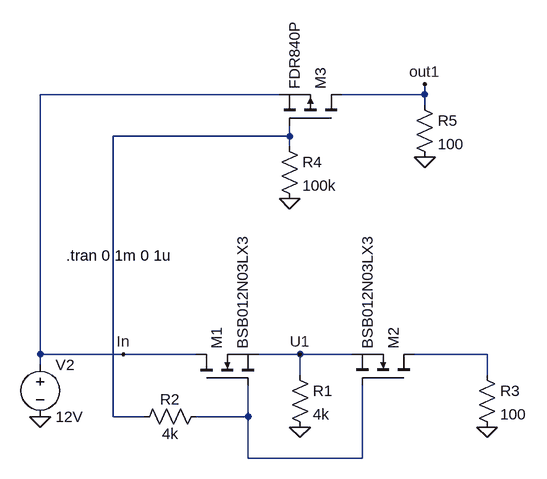
[diagram p0: schematic FET_Umschaltung.asc]
FET_Umschaltung.asc, the LTspice schematic file:
Version 4
SHEET 1 880 680
WIRE 144 -272 -224 -272
WIRE 368 -272 368 -288
WIRE 368 -272 240 -272
WIRE 368 -256 368 -272
WIRE 160 -208 160 -224
WIRE 160 -208 -112 -208
WIRE 160 -192 160 -208
WIRE -224 128 -224 -272
WIRE -96 128 -224 128
WIRE 16 128 -96 128
WIRE 176 128 112 128
WIRE 256 128 176 128
WIRE 464 128 352 128
WIRE -224 144 -224 128
WIRE 176 160 176 128
WIRE 464 160 464 128
WIRE -112 224 -112 -208
WIRE -64 224 -112 224
WIRE 96 224 96 176
WIRE 96 224 16 224
WIRE 96 288 96 224
WIRE 272 288 272 176
WIRE 272 288 96 288
FLAG 176 240 0
FLAG 464 240 0
FLAG -224 224 0
FLAG 176 128 U1
FLAG -96 128 In
FLAG 160 -112 0
FLAG 368 -176 0
FLAG 368 -288 out1
SYMBOL nmos 16 176 R270
SYMATTR InstName M1
SYMATTR Value BSB012N03LX3
SYMBOL nmos 352 176 M270
SYMATTR InstName M2
SYMATTR Value BSB012N03LX3
SYMBOL res 160 144 R0
SYMATTR InstName R1
SYMATTR Value 4k
SYMBOL res 32 208 R90
WINDOW 0 5 56 VBottom 2
WINDOW 3 27 56 VTop 2
SYMATTR InstName R2
SYMATTR Value 4k
SYMBOL res 448 144 R0
SYMATTR InstName R3
SYMATTR Value 100
SYMBOL voltage -224 128 R0
WINDOW 123 0 0 Left 2
WINDOW 39 0 0 Left 2
SYMATTR InstName V2
SYMATTR Value 12V
SYMBOL pmos 240 -224 M270
SYMATTR InstName M3
SYMATTR Value FDR840P
SYMBOL res 144 -208 R0
SYMATTR InstName R4
SYMATTR Value 100k
SYMBOL res 352 -272 R0
SYMATTR InstName R5
SYMATTR Value 100
TEXT -184 -24 Left 2 !.tran 0 1m 0 1u

The netlist it stands for:
* FET_Umschaltung.asc
M1 In N003 U1 U1 BSB012N03LX3
M2 N002 N003 U1 U1 BSB012N03LX3
R1 U1 0 4k
R2 N003 N001 4k
R3 N002 0 100
V2 In 0 12V
M3 out1 N001 In In FDR840P
R4 N001 0 100k
R5 out1 0 100
.model NMOS NMOS
.model PMOS PMOS
.lib standard.mos
.tran 0 1m 0 1u
.backanno
.end